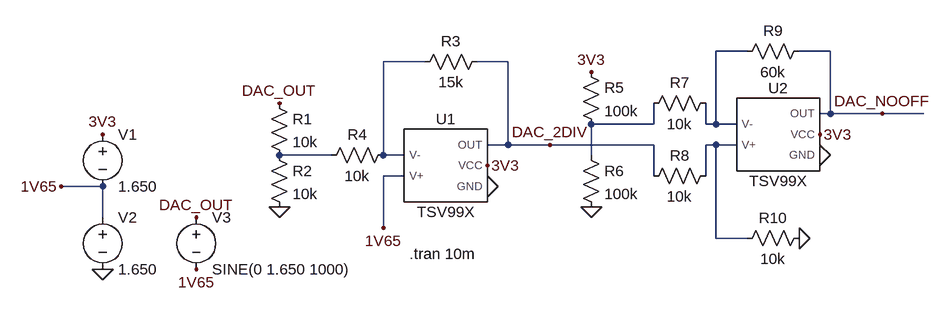
[diagram p0: schematic DAC_IN divide by 2 TSV99x.asc]
DAC_IN divide by 2 TSV99x.asc, the LTspice schematic file:
Version 4
SHEET 1 1572 680
WIRE 1120 32 1072 32
WIRE 1248 32 1200 32
WIRE 624 48 560 48
WIRE 752 48 704 48
WIRE 1248 128 1248 32
WIRE 1248 128 1232 128
WIRE 1328 128 1248 128
WIRE 1392 128 1328 128
WIRE 976 144 976 112
WIRE 976 144 880 144
WIRE 1056 144 1056 112
WIRE 1072 144 1072 32
WIRE 1072 144 1056 144
WIRE 1104 144 1072 144
WIRE 752 176 752 48
WIRE 752 176 720 176
WIRE 816 176 752 176
WIRE 976 176 816 176
WIRE 1072 176 1056 176
WIRE 1104 176 1072 176
WIRE 480 192 400 192
WIRE 560 192 560 48
WIRE 592 192 560 192
WIRE 880 192 880 144
WIRE 592 224 560 224
WIRE 976 224 976 176
WIRE 1056 224 1056 176
WIRE 128 240 64 240
WIRE 128 288 128 240
WIRE 560 304 560 224
WIRE 1072 320 1072 176
WIRE 1120 320 1072 320
FLAG 128 368 0
FLAG 128 160 3V3
FLAG 64 240 1V65
FLAG 272 288 DAC_OUT
FLAG 400 112 DAC_OUT
FLAG 816 176 DAC_2DIV
FLAG 1328 128 DAC_NOOFF
FLAG 560 304 1V65
FLAG 400 272 0
FLAG 720 208 3V3
FLAG 1232 160 3V3
FLAG 720 240 0
FLAG 1232 192 0
FLAG 272 368 1V65
FLAG 880 272 0
FLAG 880 64 3V3
FLAG 1200 320 0
SYMBOL voltage 128 144 R0
WINDOW 123 0 0 Left 2
WINDOW 39 0 0 Left 2
SYMATTR InstName V1
SYMATTR Value 1.650
SYMBOL voltage 128 272 R0
WINDOW 123 0 0 Left 2
WINDOW 39 0 0 Left 2
SYMATTR InstName V2
SYMATTR Value 1.650
SYMBOL AutoGenerated\\TSV99X 656 208 R0
SYMATTR InstName U1
SYMBOL voltage 272 272 R0
WINDOW 123 0 0 Left 2
WINDOW 39 0 0 Left 2
SYMATTR InstName V3
SYMATTR Value SINE(0 1.650 1000)
SYMBOL res 384 96 R0
SYMATTR InstName R1
SYMATTR Value 10k
SYMBOL res 384 176 R0
SYMATTR InstName R2
SYMATTR Value 10k
SYMBOL res 608 64 R270
WINDOW 0 32 56 VTop 2
WINDOW 3 0 56 VBottom 2
SYMATTR InstName R3
SYMATTR Value 15k
SYMBOL res 576 176 R90
WINDOW 0 0 56 VBottom 2
WINDOW 3 32 56 VTop 2
SYMATTR InstName R4
SYMATTR Value 10k
SYMBOL AutoGenerated\\TSV99X 1168 160 R0
SYMATTR InstName U2
SYMBOL res 864 48 R0
SYMATTR InstName R5
SYMATTR Value 100k
SYMBOL res 864 176 R0
SYMATTR InstName R6
SYMATTR Value 100k
SYMBOL res 960 128 R270
WINDOW 0 32 56 VTop 2
WINDOW 3 0 56 VBottom 2
SYMATTR InstName R7
SYMATTR Value 10k
SYMBOL res 960 240 R270
WINDOW 0 32 56 VTop 2
WINDOW 3 0 56 VBottom 2
SYMATTR InstName R8
SYMATTR Value 10k
SYMBOL res 1104 48 R270
WINDOW 0 32 56 VTop 2
WINDOW 3 0 56 VBottom 2
SYMATTR InstName R9
SYMATTR Value 60k
SYMBOL res 1104 336 R270
WINDOW 0 32 56 VTop 2
WINDOW 3 0 56 VBottom 2
SYMATTR InstName R10
SYMATTR Value 10k
TEXT 600 344 Left 2 !.tran 10m

The netlist it stands for:
* DAC_IN divide by 2 TSV99x.asc
V1 3V3 1V65 1.650
V2 1V65 0 1.650
XU1 N002 1V65 DAC_2DIV 3V3 0 TSV99X  ; pins V- V+ OUT VCC GND
V3 DAC_OUT 1V65 SINE(0 1.650 1000)
R1 DAC_OUT N005 10k
R2 N005 0 10k
R3 N002 DAC_2DIV 15k
R4 N002 N005 10k
XU2 N001 N004 DAC_NOOFF 3V3 0 TSV99X  ; pins V- V+ OUT VCC GND
R5 3V3 N003 100k
R6 N003 0 100k
R7 N003 N001 10k
R8 DAC_2DIV N004 10k
R9 N001 DAC_NOOFF 60k
R10 N004 0 10k
.tran 10m
.lib D:\Github\LTSpice\LTS0000 - Models\TSX631.mod
.backanno
.end